# Altium schematic sheet Snippet_TPS73033.SchDoc
size 840 x 594 mm
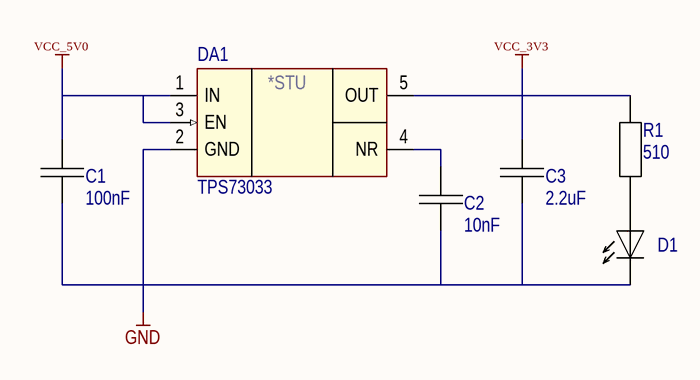
[diagram p0: Snippet_TPS73033.SchDoc]

## Parts
C1  100nF  [Capacitor_0805]
C2  10nF  [Capacitor_0805]
C3  2.2uF  [Capacitor_0805]
D1  LED_0805_G  [LED_0805_G]  (value not drawn)
DA1  TPS73033  [SOT23-5pin]
R1  510  [RESISTOR_SMD0805]

## Nets
GND: C1.2 C2.2 C3.2 D1.2 DA1.2(GND)
VCC_3V3: C3.1 DA1.5(OUT) R1.1
VCC_5V0: C1.1 DA1.1(IN) DA1.3(EN)
NetC2_1: C2.1 DA1.4(NR)
NetD1_1: D1.1 R1.2

## Notes on the sheet
- (in symbol TPS73033) *STU

## Library data of the parts
C1-C3 = Capacitor_0805
D1 = LED_0805_G: KP-2012MGC
R1 = Resistor_0805